# Altium project Siren_Buzzer Mounting.PrjPcb
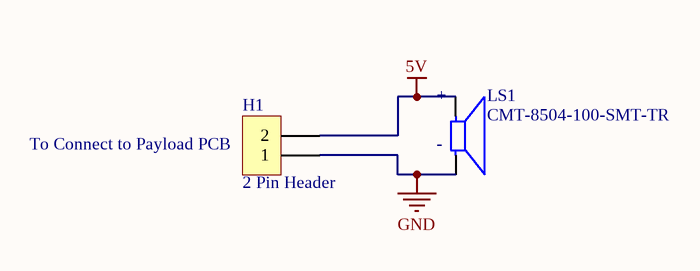
[diagram p0: Siren_Buzzer Mounting Schematic.SchDoc]
1 sheet, 2 parts. Net scope: global (net labels, ports and power ports of the same name join across sheets).
Board file: Siren_Buzzer Mounting PCB.PcbDoc

## Sheet Siren_Buzzer Mounting Schematic.SchDoc
size A4; SheetNumber: 1; SheetTotal: 1

### Parts
H1  2 Pin Header  [2 Pin Header]  (no BOM)
LS1  CMT-8504-100-SMT-TR  [XDCR_CMT-8504-100-SMT-TR]

### Nets
5V: H1.2 LS1.P
GND: H1.1 LS1.N

### Notes on the sheet
- (near H1) To Connect to Payload PCB
- (in symbol CMT-8504-100-SMT-TR) +; -

### Library data of the parts
LS1 = CMT-8504-100-SMT-TR: 8.5 mm, 5 Vo-p, 100 dB, Surface Mount (SMT), Magnetic Audio Transducer Buzzer; MF: CUI Devices; Package: CUI Devices; Purchase-URL: https://pricing.snapeda.com/search/part/CMT-8504-100-SMT-TR/?ref=eda; MP: CMT-8504-100-SMT-TR; Price: None; Availability: In Stock; Check_prices: https://www.snapeda.com/parts/CMT-8504-100-SMT-TR/CUI+Devices/view-part/?ref=eda; Value: *; SnapEDA_Link: https://www.snapeda.com/parts/CMT-8504-100-SMT-TR/CUI+Devices/view-part/?ref=snap; CUI_purchase_URL: https://www.cuidevices.com/product/audio/buzzers/audio-transducers/cmt-8504-100-smt-tr?utm_source=snapeda.com&utm_medium=referral&utm_campaign=snapedaBOM